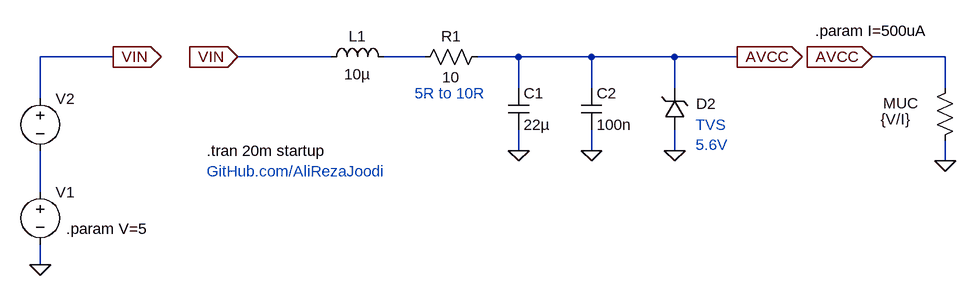
[diagram p0: schematic v1.0.asc]
v1.0.asc, the LTspice schematic file:
Version 4.1
SHEET 1 1428 680
WIRE 32 160 -80 160
WIRE 368 160 224 160
WIRE 512 160 448 160
WIRE 656 160 592 160
WIRE 768 160 656 160
WIRE 896 160 768 160
WIRE 992 160 896 160
WIRE 1312 160 1200 160
WIRE 656 208 656 160
WIRE 768 208 768 160
WIRE 896 208 896 160
WIRE 1312 208 1312 160
WIRE -80 224 -80 160
WIRE 656 304 656 272
WIRE 768 304 768 272
WIRE 896 304 896 272
WIRE 1312 320 1312 288
WIRE -80 368 -80 304
WIRE -80 480 -80 448
FLAG 768 304 0
FLAG 992 160 AVCC
IOPIN 992 160 Out
FLAG 32 160 VIN
IOPIN 32 160 Out
FLAG -80 480 0
FLAG 1312 320 0
FLAG 656 304 0
FLAG 1200 160 AVCC
IOPIN 1200 160 In
FLAG 224 160 VIN
IOPIN 224 160 In
FLAG 896 304 0
SYMBOL ind 352 176 R270
WINDOW 0 32 56 VTop 2
WINDOW 3 5 56 VBottom 2
SYMATTR InstName L1
SYMATTR Value 10µ
SYMATTR SpiceLine Rser=0.3
SYMBOL cap 752 208 R0
SYMATTR InstName C2
SYMATTR Value 100n
SYMATTR SpiceLine Rser=0.5
SYMBOL voltage -80 352 R0
WINDOW 3 41 64 Invisible 2
WINDOW 123 0 0 Left 0
WINDOW 39 0 0 Left 0
SYMATTR Value PULSE(0 {V} 5m 1n 1n 10m 11m 1)
SYMATTR InstName V1
SYMBOL res 1328 192 M0
WINDOW 0 111 39 Right 2
WINDOW 3 115 64 Right 2
SYMATTR InstName MUC
SYMATTR Value {V/I}
SYMBOL res 608 144 R90
WINDOW 0 0 56 VBottom 2
WINDOW 3 32 56 VTop 2
SYMATTR InstName R1
SYMATTR Value 10
SYMBOL cap 640 208 R0
SYMATTR InstName C1
SYMATTR Value 22µ
SYMATTR SpiceLine Rser=0.5
SYMBOL voltage -80 208 R0
WINDOW 3 41 64 Invisible 2
WINDOW 123 0 0 Left 0
WINDOW 39 0 0 Left 0
SYMATTR Value PULSE(0 6 10m 1n 1n 10u 20u 1)
SYMATTR InstName V2
SYMBOL zener 880 272 M180
WINDOW 0 49 40 Left 2
WINDOW 3 49 16 Invisible 2
SYMATTR InstName D2
SYMATTR Value STZ5_6N
TEXT 176 304 Left 2 !.tran 20m startup
TEXT 496 216 Left 2 ;5R to 10R
TEXT 928 264 Left 2 ;TVS\n5.6V
TEXT 176 336 Left 2 ;GitHub.com/AliRezaJoodi
TEXT -40 424 Left 2 !.param V=5
TEXT 1112 120 Left 2 !.param I=500uA

The netlist it stands for:
* v1.0.asc
L1 VIN N001 10µ Rser=0.3
C2 AVCC 0 100n Rser=0.5
V1 N002 0 PULSE(0 {V} 5m 1n 1n 10m 11m 1)
R§MUC AVCC 0 {V/I}
R1 AVCC N001 10
C1 AVCC 0 22µ Rser=0.5
V2 VIN N002 PULSE(0 6 10m 1n 1n 10u 20u 1)
D2 0 AVCC STZ5_6N
.model D D
.lib standard.dio
.tran 20m startup
* 5R to 10R
* TVS
* 5.6V
* GitHub.com/AliRezaJoodi
.param V=5
.param I=500uA
.backanno
.end